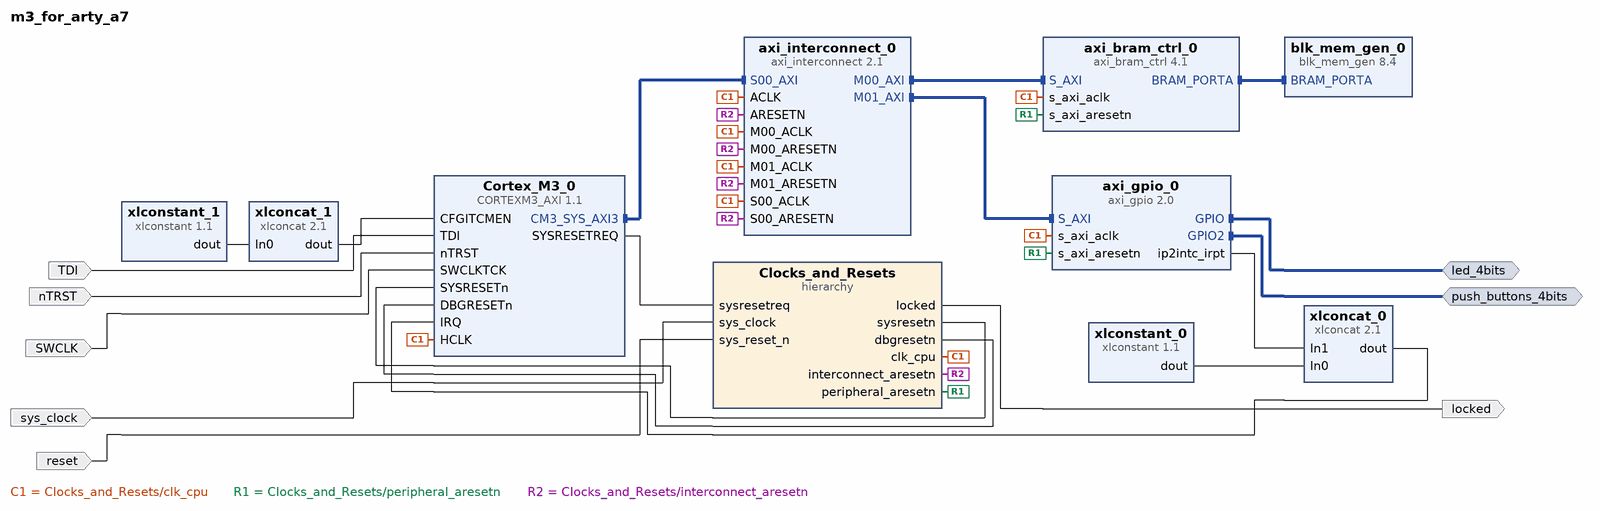
[diagram p0: block diagram of the top level]
# Vivado block design m3_for_arty_a7, xc7a35ticsg324-1L, Vivado 2019.1
create_bd_design m3_for_arty_a7

create_bd_intf_port -mode Master -vlnv xilinx.com:interface:gpio_rtl:1.0 led_4bits
create_bd_intf_port -mode Master -vlnv xilinx.com:interface:gpio_rtl:1.0 push_buttons_4bits
create_bd_port -dir I -type clk sys_clock
set_property -dict {CONFIG.FREQ_HZ 100000000 CONFIG.PHASE 0.000} [get_bd_ports sys_clock]
create_bd_port -dir I TDI
create_bd_port -dir I nTRST
create_bd_port -dir I -type rst reset
set_property -dict {CONFIG.POLARITY ACTIVE_LOW} [get_bd_ports reset]
create_bd_port -dir O -type data locked
create_bd_port -dir I -type clk SWCLK
set_property -dict {CONFIG.FREQ_HZ 20000000} [get_bd_ports SWCLK]

create_bd_cell -type hier Clocks_and_Resets
create_bd_cell -type ip -vlnv xilinx.com:ip:axi_gpio:2.0 axi_gpio_0
set_property -dict [list \
  CONFIG.C_INTERRUPT_PRESENT 1 \
  CONFIG.GPIO2_BOARD_INTERFACE push_buttons_4bits \
  CONFIG.GPIO_BOARD_INTERFACE led_4bits \
  CONFIG.USE_BOARD_FLOW true \
] [get_bd_cells axi_gpio_0]
create_bd_cell -type ip -vlnv xilinx.com:ip:axi_interconnect:2.1 axi_interconnect_0
set_property -dict [list \
  CONFIG.ENABLE_ADVANCED_OPTIONS 1 \
  CONFIG.M00_HAS_DATA_FIFO 0 \
  CONFIG.M00_HAS_REGSLICE 0 \
  CONFIG.M00_SECURE 0 \
  CONFIG.M01_HAS_DATA_FIFO 0 \
  CONFIG.M01_HAS_REGSLICE 3 \
  CONFIG.M01_SECURE 0 \
  CONFIG.M02_HAS_REGSLICE 3 \
  CONFIG.M02_SECURE 0 \
  CONFIG.M03_HAS_REGSLICE 3 \
  CONFIG.M04_HAS_REGSLICE 3 \
  CONFIG.M05_HAS_REGSLICE 3 \
  CONFIG.NUM_MI 2 \
  CONFIG.NUM_SI 1 \
  CONFIG.S00_HAS_REGSLICE 3 \
  CONFIG.S01_HAS_DATA_FIFO 1 \
  CONFIG.S01_HAS_REGSLICE 3 \
  CONFIG.SYNCHRONIZATION_STAGES 2 \
] [get_bd_cells axi_interconnect_0]
create_bd_cell -type ip -vlnv xilinx.com:ip:xlconcat:2.1 xlconcat_1
set_property -dict {CONFIG.IN6_WIDTH 25 CONFIG.NUM_PORTS 1} [get_bd_cells xlconcat_1]
create_bd_cell -type ip -vlnv xilinx.com:ip:xlconstant:1.1 xlconstant_1
set_property -dict {CONFIG.CONST_VAL 1 CONFIG.CONST_WIDTH 2} [get_bd_cells xlconstant_1]
create_bd_cell -type ip -vlnv Arm.com:CortexM:CORTEXM3_AXI:1.1 Cortex_M3_0
set_property -dict [list \
  CONFIG.DEBUG_LVL 2 \
  CONFIG.DTCM_SIZE {"0110"} \
  CONFIG.ITCM_INIT_FILE bram_a7.hex \
  CONFIG.ITCM_SIZE {"0110"} \
  CONFIG.TRACE_LVL 1 \
  CONFIG.WIC_PRESENT false \
] [get_bd_cells Cortex_M3_0]
create_bd_cell -type ip -vlnv xilinx.com:ip:xlconcat:2.1 xlconcat_0
create_bd_cell -type ip -vlnv xilinx.com:ip:xlconstant:1.1 xlconstant_0
create_bd_cell -type ip -vlnv xilinx.com:ip:axi_bram_ctrl:4.1 axi_bram_ctrl_0
set_property -dict {CONFIG.PROTOCOL AXI4LITE CONFIG.SINGLE_PORT_BRAM 1} [get_bd_cells axi_bram_ctrl_0]
create_bd_cell -type ip -vlnv xilinx.com:ip:blk_mem_gen:8.4 blk_mem_gen_0
set_property -dict {CONFIG.EN_SAFETY_CKT false} [get_bd_cells blk_mem_gen_0]

# ---- hierarchy /Clocks_and_Resets ----
current_bd_instance /Clocks_and_Resets
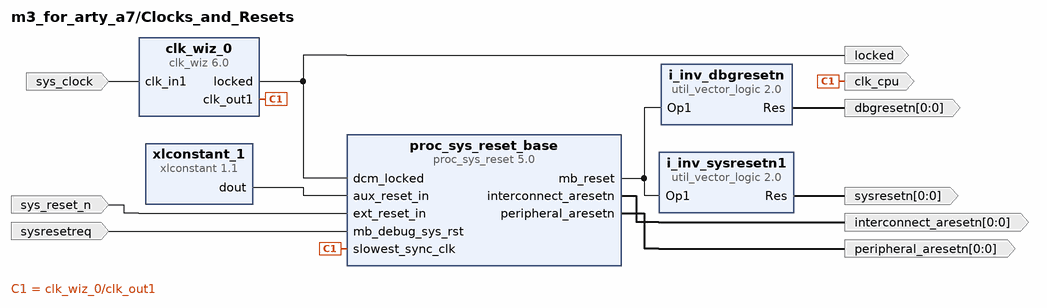
[diagram p1: block diagram inside /Clocks_and_Resets]
create_bd_pin -dir O -from 0 -to 0 -type rst interconnect_aresetn
create_bd_pin -dir O -from 0 -to 0 -type rst peripheral_aresetn
create_bd_pin -dir O -type clk clk_cpu
create_bd_pin -dir I -type clk sys_clock
create_bd_pin -dir O -from 0 -to 0 sysresetn
create_bd_pin -dir O -from 0 -to 0 dbgresetn
create_bd_pin -dir I sysresetreq
create_bd_pin -dir I -type rst sys_reset_n
create_bd_pin -dir O locked

create_bd_cell -type ip -vlnv xilinx.com:ip:proc_sys_reset:5.0 proc_sys_reset_base
set_property -dict [list \
  CONFIG.C_AUX_RST_WIDTH 1 \
  CONFIG.C_EXT_RST_WIDTH 1 \
  CONFIG.RESET_BOARD_INTERFACE reset \
  CONFIG.USE_BOARD_FLOW true \
] [get_bd_cells proc_sys_reset_base]
create_bd_cell -type ip -vlnv xilinx.com:ip:util_vector_logic:2.0 i_inv_dbgresetn
set_property -dict {CONFIG.C_OPERATION not CONFIG.C_SIZE 1} [get_bd_cells i_inv_dbgresetn]
create_bd_cell -type ip -vlnv xilinx.com:ip:util_vector_logic:2.0 i_inv_sysresetn1
set_property -dict {CONFIG.C_OPERATION not CONFIG.C_SIZE 1} [get_bd_cells i_inv_sysresetn1]
create_bd_cell -type ip -vlnv xilinx.com:ip:clk_wiz:6.0 clk_wiz_0
set_property -dict [list \
  CONFIG.CLKIN1_JITTER_PS 833.33 \
  CONFIG.CLKIN2_JITTER_PS 833.33 \
  CONFIG.CLKOUT1_DRIVES BUFGCE \
  CONFIG.CLKOUT1_JITTER 151.636 \
  CONFIG.CLKOUT1_PHASE_ERROR 98.575 \
  CONFIG.CLKOUT1_REQUESTED_OUT_FREQ 50.0 \
  CONFIG.CLKOUT2_DRIVES BUFGCE \
  CONFIG.CLKOUT2_JITTER 151.636 \
  CONFIG.CLKOUT2_PHASE_ERROR 98.575 \
  CONFIG.CLKOUT2_REQUESTED_OUT_FREQ 50.0 \
  CONFIG.CLKOUT2_USED false \
  CONFIG.CLKOUT3_DRIVES BUFGCE \
  CONFIG.CLKOUT4_DRIVES BUFGCE \
  CONFIG.CLKOUT5_DRIVES BUFGCE \
  CONFIG.CLKOUT6_DRIVES BUFGCE \
  CONFIG.CLKOUT7_DRIVES BUFGCE \
  CONFIG.CLK_IN1_BOARD_INTERFACE sys_clock \
  CONFIG.CLK_IN2_BOARD_INTERFACE Custom \
  CONFIG.FEEDBACK_SOURCE FDBK_AUTO \
  CONFIG.MMCM_CLKFBOUT_MULT_F 10.000 \
  CONFIG.MMCM_CLKIN1_PERIOD 10.000 \
  CONFIG.MMCM_CLKIN2_PERIOD 10.000 \
  CONFIG.MMCM_CLKOUT0_DIVIDE_F 20.000 \
  CONFIG.MMCM_CLKOUT1_DIVIDE 1 \
  CONFIG.MMCM_DIVCLK_DIVIDE 1 \
  CONFIG.NUM_OUT_CLKS 1 \
  CONFIG.RESET_BOARD_INTERFACE Custom \
  CONFIG.SECONDARY_SOURCE Single_ended_clock_capable_pin \
  CONFIG.USE_BOARD_FLOW true \
  CONFIG.USE_INCLK_SWITCHOVER false \
  CONFIG.USE_RESET false \
  CONFIG.USE_SAFE_CLOCK_STARTUP true \
] [get_bd_cells clk_wiz_0]
create_bd_cell -type ip -vlnv xilinx.com:ip:xlconstant:1.1 xlconstant_1

# ---- connections ----

current_bd_instance /Clocks_and_Resets
connect_bd_net -net dcm_locked_1 [get_bd_pins clk_wiz_0/locked] [get_bd_pins proc_sys_reset_base/dcm_locked] [get_bd_pins locked]
connect_bd_net [get_bd_pins clk_wiz_0/clk_out1] [get_bd_pins clk_cpu] [get_bd_pins proc_sys_reset_base/slowest_sync_clk]
connect_bd_net [get_bd_pins sys_clock] [get_bd_pins clk_wiz_0/clk_in1]
connect_bd_net [get_bd_pins proc_sys_reset_base/mb_reset] [get_bd_pins i_inv_dbgresetn/Op1] [get_bd_pins i_inv_sysresetn1/Op1]
connect_bd_net [get_bd_pins i_inv_sysresetn1/Res] [get_bd_pins sysresetn]
connect_bd_net [get_bd_pins i_inv_dbgresetn/Res] [get_bd_pins dbgresetn]
connect_bd_net [get_bd_pins sys_reset_n] [get_bd_pins proc_sys_reset_base/ext_reset_in]
connect_bd_net [get_bd_pins proc_sys_reset_base/peripheral_aresetn] [get_bd_pins peripheral_aresetn]
connect_bd_net [get_bd_pins proc_sys_reset_base/interconnect_aresetn] [get_bd_pins interconnect_aresetn]
connect_bd_net [get_bd_pins sysresetreq] [get_bd_pins proc_sys_reset_base/mb_debug_sys_rst]
connect_bd_net [get_bd_pins xlconstant_1/dout] [get_bd_pins proc_sys_reset_base/aux_reset_in]

current_bd_instance /
connect_bd_intf_net [get_bd_intf_pins axi_gpio_0/S_AXI] [get_bd_intf_pins axi_interconnect_0/M01_AXI]
connect_bd_intf_net [get_bd_intf_pins Cortex_M3_0/CM3_SYS_AXI3] [get_bd_intf_pins axi_interconnect_0/S00_AXI]
connect_bd_intf_net [get_bd_intf_ports push_buttons_4bits] [get_bd_intf_pins axi_gpio_0/GPIO2]
connect_bd_intf_net [get_bd_intf_pins axi_interconnect_0/M00_AXI] [get_bd_intf_pins axi_bram_ctrl_0/S_AXI]
connect_bd_intf_net [get_bd_intf_pins blk_mem_gen_0/BRAM_PORTA] [get_bd_intf_pins axi_bram_ctrl_0/BRAM_PORTA]
connect_bd_intf_net [get_bd_intf_ports led_4bits] [get_bd_intf_pins axi_gpio_0/GPIO]
connect_bd_net -net clk_wiz_0_clk_out1 [get_bd_pins Clocks_and_Resets/clk_cpu] \
  [get_bd_pins axi_gpio_0/s_axi_aclk] [get_bd_pins axi_interconnect_0/ACLK] [get_bd_pins axi_interconnect_0/S00_ACLK] \
  [get_bd_pins axi_interconnect_0/M00_ACLK] [get_bd_pins axi_interconnect_0/M01_ACLK] [get_bd_pins Cortex_M3_0/HCLK] \
  [get_bd_pins axi_bram_ctrl_0/s_axi_aclk]
connect_bd_net -net proc_sys_reset_1_interconnect_aresetn [get_bd_pins Clocks_and_Resets/peripheral_aresetn] \
  [get_bd_pins axi_gpio_0/s_axi_aresetn] [get_bd_pins axi_bram_ctrl_0/s_axi_aresetn]
connect_bd_net -net proc_sys_reset_1_peripheral_aresetn [get_bd_pins Clocks_and_Resets/interconnect_aresetn] \
  [get_bd_pins axi_interconnect_0/S00_ARESETN] [get_bd_pins axi_interconnect_0/M00_ARESETN] \
  [get_bd_pins axi_interconnect_0/M01_ARESETN] [get_bd_pins axi_interconnect_0/ARESETN]
connect_bd_net [get_bd_ports sys_clock] [get_bd_pins Clocks_and_Resets/sys_clock]
connect_bd_net [get_bd_pins Clocks_and_Resets/sysresetn] [get_bd_pins Cortex_M3_0/SYSRESETn]
connect_bd_net [get_bd_pins Clocks_and_Resets/dbgresetn] [get_bd_pins Cortex_M3_0/DBGRESETn]
connect_bd_net [get_bd_pins xlconcat_1/dout] [get_bd_pins Cortex_M3_0/CFGITCMEN]
connect_bd_net [get_bd_ports TDI] [get_bd_pins Cortex_M3_0/TDI]
connect_bd_net [get_bd_ports nTRST] [get_bd_pins Cortex_M3_0/nTRST]
connect_bd_net [get_bd_pins Cortex_M3_0/SYSRESETREQ] [get_bd_pins Clocks_and_Resets/sysresetreq]
connect_bd_net [get_bd_ports reset] [get_bd_pins Clocks_and_Resets/sys_reset_n]
connect_bd_net [get_bd_pins Clocks_and_Resets/locked] [get_bd_ports locked]
connect_bd_net [get_bd_ports SWCLK] [get_bd_pins Cortex_M3_0/SWCLKTCK]
connect_bd_net [get_bd_pins xlconstant_1/dout] [get_bd_pins xlconcat_1/In0]
connect_bd_net [get_bd_pins axi_gpio_0/ip2intc_irpt] [get_bd_pins xlconcat_0/In1]
connect_bd_net [get_bd_pins xlconcat_0/dout] [get_bd_pins Cortex_M3_0/IRQ]
connect_bd_net [get_bd_pins xlconstant_0/dout] [get_bd_pins xlconcat_0/In0]

# ---- address map ----
assign_bd_address -offset 0x40110000 -range 64K -target_address_space [get_bd_addr_spaces Cortex_M3_0/CM3_SYS_AXI3] [get_bd_addr_segs axi_gpio_0/S_AXI/Reg]
assign_bd_address -offset 0x60000000 -range 8K -target_address_space [get_bd_addr_spaces Cortex_M3_0/CM3_SYS_AXI3] [get_bd_addr_segs axi_bram_ctrl_0/S_AXI/Mem0]

validate_bd_design
save_bd_design
